# EAGLE design sensor-multichannel (EAGLE 9.6.2)
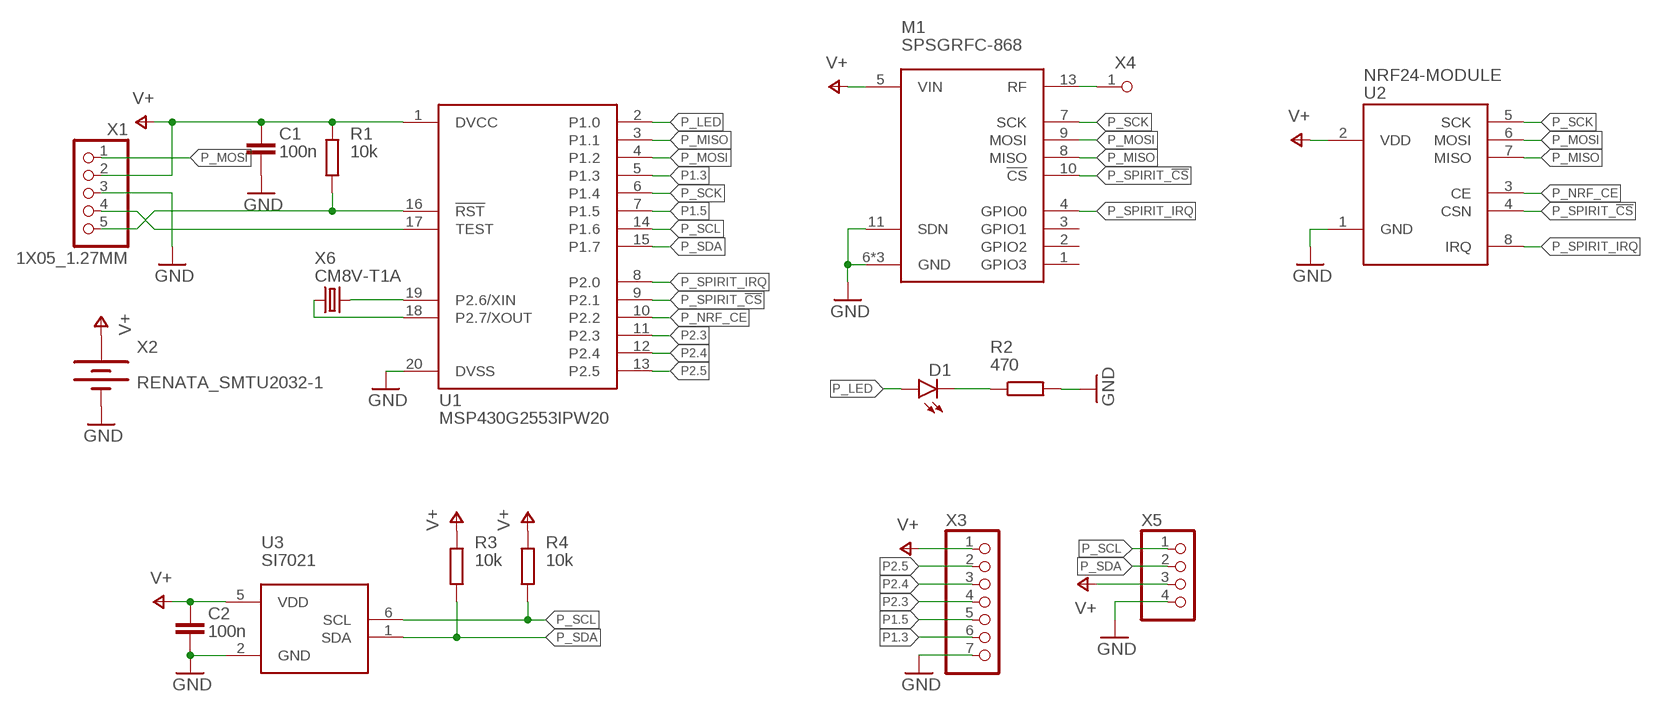
[diagram p0: schematic, sheet 1]

## Parts
C1  100n  C0603  [C0603]
C2  100n  C0603  [C0603]
D1  LEDCHIPLED_0805  [CHIPLED_0805]
M1  SPSGRFC-868  [SPSGRFC-868]
R1  10k  R0603  [R0603]
R2  470  R0603  [R0603]
R3  10k  R0603  [R0603]
R4  10k  R0603  [R0603]
U1  MSP430G2553IPW20  [PW20]
U2  NRF24-MODULE  [NRF24-MODULE]
U3  SI7021  [DFN6-3X3]
X1  1X05_1.27MM  [1X05_1.27MM]
X2  RENATA_SMTU2032-1  [RENATA_SMTU2032-1]
X3  PINHD_7_RNDNS  [1X07_NOSILK]
X4  PINHD_1_RND  [1X01_NOSILK]
X5  PINHD_4_RNDNS  [1X04_NOSILK]
X6  CM8V-T1A  [CM8V-T1A]

## Nets
GND: C1.2 C2.2 M1.6(GND) M1.11(SDN) M1.12(GND) M1.14(GND) R2.2 U1.20(DVSS) U2.1(GND) U3.2(GND) X1.3 X2.2(-) X3.7 X5.4
N$1: D1.C R2.1
N$2: R1.1 U1.16(!RST!) X1.5
N$3: U1.17(TEST) X1.4
N$4: M1.13(RF) X4.1
N$5: U1.19(P2.6/XIN) X6.P$2
N$6: U1.18(P2.7/XOUT) X6.P$1
P1.3: U1.5(P1.3) X3.6
P1.5: U1.7(P1.5) X3.5
P2.3: U1.11(P2.3) X3.4
P2.4: U1.12(P2.4) X3.3
P2.5: U1.13(P2.5) X3.2
P_LED: D1.A U1.2(P1.0)
P_MISO: M1.8(MISO) U1.3(P1.1) U2.7(MISO)
P_MOSI: M1.9(MOSI) U1.4(P1.2) U2.6(MOSI) X1.1
P_NRF_CE: U1.10(P2.2) U2.3(CE)
P_SCK: M1.7(SCK) U1.6(P1.4) U2.5(SCK)
P_SCL: R4.1 U1.14(P1.6) U3.6(SCL) X5.1
P_SDA: R3.1 U1.15(P1.7) U3.1(SDA) X5.2
P_SPIRIT_!CS: M1.10(!CS) U1.9(P2.1) U2.4(CSN)
P_SPIRIT_IRQ: M1.4(GPIO0) U1.8(P2.0) U2.8(IRQ)
V+: C1.1 C2.1 M1.5(VIN) R1.2 R3.2 R4.2 U1.1(DVCC) U2.2(VDD) U3.5(VDD) X1.2 X2.1(+) X3.1 X5.3
Unconnected: M1.1(GPIO3) M1.2(GPIO2) M1.3(GPIO1)

## Library data of the parts
C1 C2 = rfr-lib-passive:C: Standard-SMD-Kondensatoren
D1 = led:LED: LED OSRAM: - CHIPLED LG R971, LG N971, LY N971, LG Q971, LY Q971, LO R971, LY R971 LH N974, LH R974 LS Q976, LO Q976, LY Q976 LO Q996 - Hyper CHIPLED LW Q18S LB Q993, LB Q99A, LB R99A - SideLED LS A670, LO A670, LY A670, LG A670, LP A670 LB A673, LV A673, LT A673, LW A673 LH A674 LY A675 LS A676, LA A676, LO A676, LY A676, LW A676 LS A679, LY A679, LG A679 - Hyper Micro SIDELED® LS Y876, LA Y876, LO Y876, LY Y876 LT Y87S - SmartLED LW L88C, LW L88S LB L89C, LB L89S, LG L890 LS L89K, LO L89K, LY L89K LS L896, LA L896, LO L896, LY L896 - TOPLED LS T670, LO T670, LY T670, LG T670, LP T670 LSG T670, LSP T670, LSY T670, LOP T670, LYG T670 LG T671, LOG T671, LSG T671 LB T673, LV T673, LT T673, LW T673 LH T674 LS T676, LA T676, LO T676, LY T676, LB T676, LH T676, LSB T676, LW T676 LB T67C, LV T67C, LT T67C, LS T67K, LO T67K, LY T67K, LW E67C LS E67B, LA E67B, LO E67B, LY E67B, LB E67C, LV E67C, LT E67C LW T67C LS T679, LY T679, LG T679 LS T770, LO T770, LY T770, LG T770, LP T770 LB T773, LV T773, LT T773, LW T773 LH T774 LS E675, LA E675, LY E675, LS T675 LS T776, LA T776, LO T776, LY T776, LB T776 LHGB T686 LT T68C, LB T68C - Hyper Mini TOPLED® LB M676 - Mini TOPLED Santana® LG M470 LS M47K, LO M47K, LY M47K Source: http://www.osram.convergy.de LUXEON: - LUMILED® LXK2-PW12-R00, LXK2-PW12-S00, LXK2-PW14-U00, LXK2-PW14-V00 LXK2-PM12-R00, LXK2-PM12-S00, LXK2-PM14-U00 LXK2-PE12-Q00, LXK2-PE12-R00, LXK2-PE12-S00, LXK2-PE14-T00, LXK2-PE14-U00 LXK2-PB12-K00, LXK2-PB12-L00, LXK2-PB12-M00, LXK2-PB14-N00, LXK2-PB14-P00, LXK2-PB14-Q00 LXK2-PR12-L00, LXK2-PR12-M00, LXK2-PR14-Q00, LXK2-PR14-R00 LXK2-PD12-Q00, LXK2-PD12-R00, LXK2-PD12-S00 LXK2-PH12-R00, LXK2-PH12-S00 LXK2-PL12-P00, LXK2-PL12-Q00, LXK2-PL12-R00 Source: www.luxeon.com KINGBRIGHT: KA-3528ASYC Source: www.kingbright.com
M1 = rfr-lib-radio:SPSGRFC-868
R1-R4 = rfr-lib-passive:R: Standard-SMD-Widerstände
U1 = rfr-lib-digital:MSP430G2553: MSP430G2XX1 TSSOP (PW) 20 Pin Package
U2 = rfr-lib-radio:NRF24-MODULE
U3 = rfr-lib-sensors:SI7021
X1 = msp430-nrf-wsn-lib:1X05_1.27MM
X2 = msp430-nrf-wsn-lib:RENATA_SMTU2032-1
X3 = rfr-lib-connector:PINHD_7_RND: PIN HEADER
X4 = rfr-lib-connector:PINHD_1_RND
X5 = rfr-lib-connector:PINHD_4_RND
X6 = rfr-lib-passive:CM8V-T1A

## Board
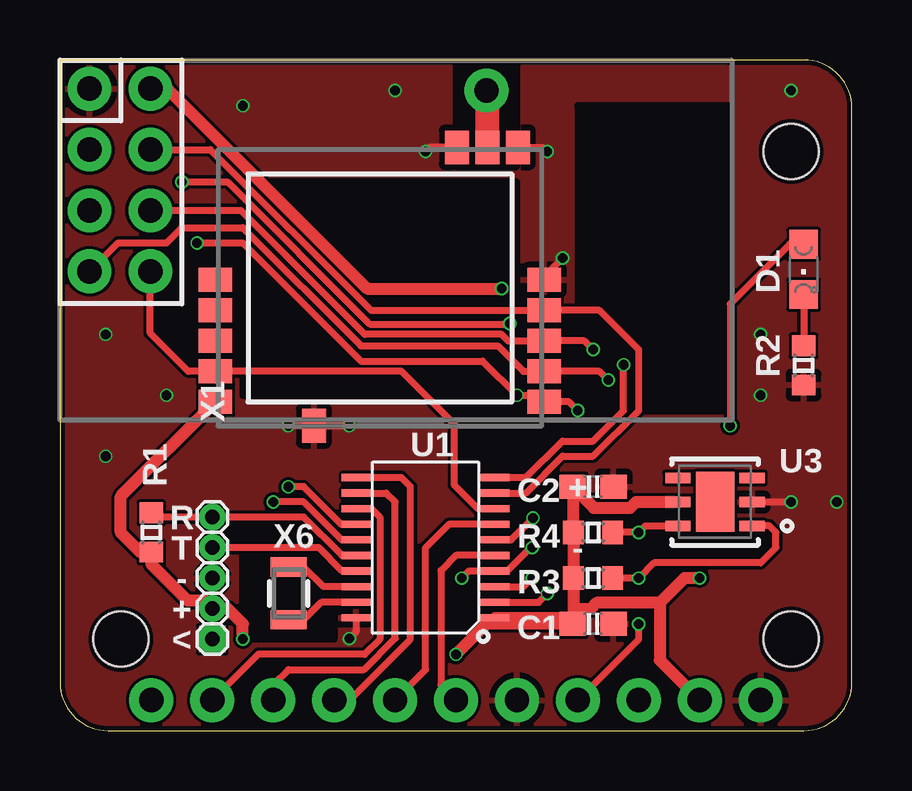
[diagram p1: board, top side]
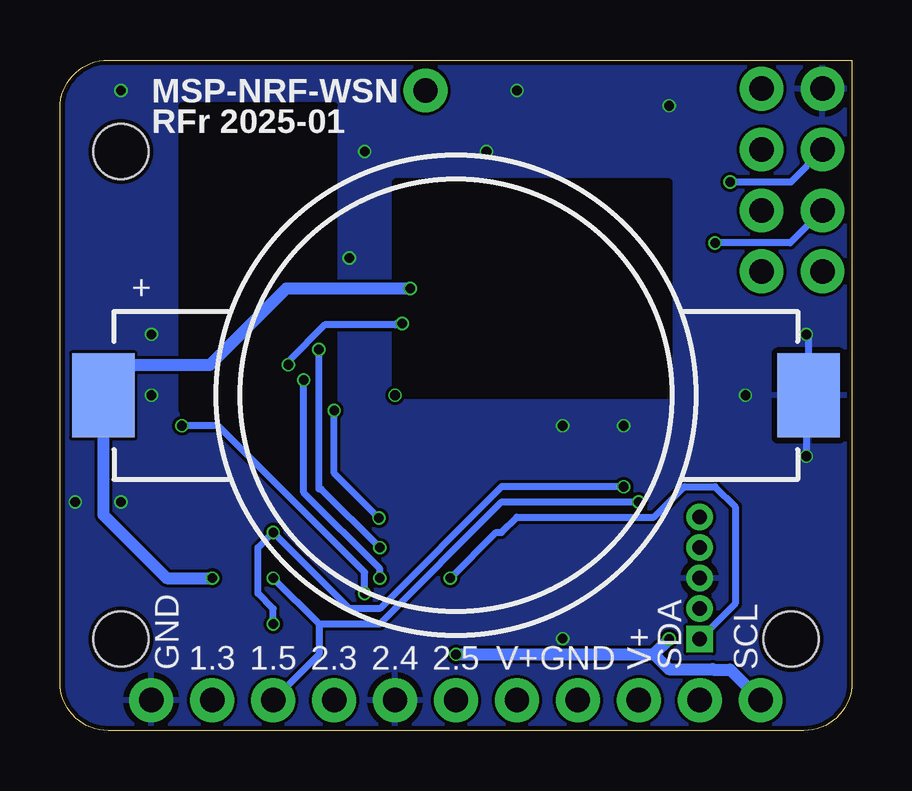
[diagram p2: board, bottom side, seen from below]

Size 33.02 x 27.94 mm. Coordinates in mm from the lower left corner, seen from the top.
Outline: 0,27.94 0,2 arc90 2,0 31.02,0 arc90 33.02,2 33.02,25.94 arc90 31.02,27.94 0,27.94
Copper layers (1*16): Top 0.035mm / dielectric 1.6mm / Bottom 0.035mm
Design rules "jlcpcb-2layers *": minimum track width 5mil, minimum drill 0.3mm, track to track 5mil, track to pad 5mil, pad to pad 5mil, via to via 5mil, smd to smd 5mil, copper to edge 0.2mm, drill to drill 6mil, minimum pad ring 10mil, minimum via ring 3mil, stop-mask expansion 4mil, vias tented up to drill 0.7mm, thermal gap 10mil
Holes 2.3 mm at 48.26,-15.24 2.54,3.81 30.48,3.81 30.48,24.13

### Footprints (pad centres in the part's own frame; a part is rotated, then mirrored left to right if it is on the bottom)
C0603 = smd 1.1 x 1: 1 -0.85,0; 2 0.85,0
CHIPLED_0805 = smd 1.2 x 1.2: A 0,-1.05; C 0,1.05
SPSGRFC-868 = smd 1.4 x 1: 1 -6.85,6.08; 2 -6.85,4.81; 3 -6.85,3.54; 4 -6.85,2.27; 5 -6.85,1; 7 6.85,1; 8 6.85,2.27; 9 6.85,3.54; 10 6.85,4.81; 11 6.85,6.08 | smd 1 x 1.4: 6 -2.75,0; 12 5.75,11.6; 13 4.48,11.6; 14 3.21,11.6
R0603 = smd 0.87 x 0.98: 1 -0.815,0; 2 0.815,0
PW20 = smd 0.3 x 1.2: 1 -2.925,-2.9; 2 -2.275,-2.9; 3 -1.625,-2.9; 4 -0.975,-2.9; 5 -0.325,-2.9; 6 0.325,-2.9; 7 0.975,-2.9; 8 1.625,-2.9; 9 2.275,-2.9; 10 2.925,-2.9; 11 2.925,2.9; 12 2.275,2.9; 13 1.625,2.9; 14 0.975,2.9; 15 0.325,2.9; 16 -0.325,2.9; 17 -0.975,2.9; 18 -1.625,2.9; 19 -2.275,2.9; 20 -2.925,2.9
NRF24-MODULE = drill 1.016 pad 1.778: 1 1.19,1.23; 2 1.19,3.77; 3 3.73,1.23; 4 3.73,3.77; 5 6.27,1.23; 6 6.27,3.77; 7 8.81,1.23; 8 8.81,3.77
DFN6-3X3 = smd 1.05 x 0.45: 1 -1.55,1; 2 -1.55,0; 3 -1.55,-1; 4 1.55,-1; 5 1.55,0; 6 1.55,1 | smd 1.6 x 2.5: EXP 0,0
1X05_1.27MM = drill 0.6 square: 1 -2.54,0 | drill 0.6: 2 -1.27,0; 3 0,0; 4 1.27,0; 5 2.54,0
RENATA_SMTU2032-1 = smd 2.6 x 3.5: 1 -14.7,0; 2 14.7,0
1X07_NOSILK = drill 1.016 pad 1.778: 1 -7.62,0; 2 -5.08,0; 3 -2.54,0; 4 0,0; 5 2.54,0; 6 5.08,0; 7 7.62,0
1X01_NOSILK = drill 1.016 pad 1.778: 1 0,0
1X04_NOSILK = drill 1.016 pad 1.778: 1 -3.81,0; 2 -1.27,0; 3 1.27,0; 4 3.81,0
CM8V-T1A = smd 0.8 x 1.5: P$1 -1.1,0; P$2 1.1,0

### Placement (x,y rotation side)
C1  22.23,4.45 0 top
C2  22.23,10.16 0 top
D1  31,19.21 180 top
M1  13.34,12.7 0 top
R1  3.81,8.25 270 top
R2  31,15.21 270 top
R3  22.23,6.35 180 top
R4  22.23,8.25 180 top
U1  15.24,7.62 90 top
U2  0,27.94 270 top
U3  27.3,9.53 180 top
X1  6.35,6.35 90 top
X2  16.51,13.97 0 bottom
X3  11.43,1.27 0 top
X4  17.78,26.67 0 top
X5  25.4,1.27 0 top
X6  9.53,5.71 270 top

### Tracks (layer width: path | path; a pad name or v marks a point on that pad's centre or on a via)
GND  (via drill 0.4)
  Top 0.3: M1.14 15.41,24.3 v15.24,24.13 | M1.12 20.15,24.3 v20.32,24.13 | v20.95,19.68 20.18,18.91 M1.11 | v12.06,12.7 M1.6 v9.53,12.7 | U3.2 v30.48,9.53 | U1.20 12.34,4.1 v12.06,3.83
  Bottom 0.3: v1.91,16.51 1.81,16.41 X2.2 1.91,13.88 v1.91,11.43
  other vias: 32.38,9.53 29.21,13.97 29.21,16.51 7.62,26.04 4.45,13.97 13.97,26.67 30.48,26.67
  pour Top: -0.64,28.57 34.29,28.57 34.29,-1.27 -0.64,-1.27
  pour Bottom: 33.66,29.21 -1.27,29.21 -1.27,-0.63 33.66,-0.63
  cutout Top: 11.43,3.81 7.62,3.81 7.62,7.62 11.43,7.62
  cutout Bottom: 7.62,13.97 7.62,22.86 19.05,22.86 19.05,13.97
  cutout Top: 19.05,13.97 19.05,22.86 7.62,22.86 7.62,13.97
  cutout Top: 19.05,23.49 19.05,27.94 16.51,27.94 16.51,23.49
  cutout Top: 21.59,26.04 21.59,13.34 27.94,13.34 27.94,26.04
  cutout Bottom: 27.94,26.04 27.94,13.34 21.59,13.34 21.59,26.04
N$1
  Top 0.3: D1.C R2.1
N$2
  Top 0.3: U1.16 11.76,7.29 10.16,8.89 X1.5 3.99,8.89 R1.1
N$3
  Top 0.3: U1.17 11.77,6.65 10.79,7.62 7.62,7.62 X1.4
N$4
  Top 1: M1.13 17.82,26.63 X4.1
N$5
  Top 0.3: U1.19 10.89,5.35 10.16,4.62 X6.P$2
N$6
  Top 0.3: U1.18 10.98,6 10.16,6.82 X6.P$1
P1.3
  Top 0.3: U1.5 16.5,7.29 15.88,6.67 15.88,1.91 X3.6
P1.5
  Top 0.3: U1.7 16.21,8.59 15.24,7.62 15.24,2.54 X3.5
P2.3
  Top 0.3: U1.11 14.22,10.55 14.61,10.16 14.61,3.81 12.06,1.27 X3.4
P2.4
  Top 0.3: U1.12 13.6,9.89 13.97,9.53 13.97,3.84 12.67,2.54 9.53,2.54 8.89,1.91 X3.3
P2.5
  Top 0.3: U1.13 12.98,9.25 13.34,8.89 13.34,3.81 12.7,3.17 8.26,3.17 X3.2
P_LED  (via drill 0.4)
  Top 0.3: D1.A 30.43,20.27 27.94,17.78 v27.94,12.7 | U1.2 19.95,5.35 v20.32,5.71
  Bottom 0.3: v27.94,12.7 26.43,12.7 20.32,6.59 v20.32,5.71
P_MISO  (via drill 0.4)
  Top 0.3: v22.86,14.61 22.5,14.97 M1.8 19.32,14.97 18.26,16.03 12.54,16.03 7.62,20.95 5.08,20.95 4.45,20.32 2.42,20.32 U2.7 | U1.3 19.33,6 v19.68,6.35
  Bottom 0.3: v22.86,14.61 22.86,9.91 19.68,6.74 v19.68,6.35
P_MOSI  (via drill 0.4)
  Top 0.3: v22.23,15.88 21.86,16.24 M1.9 18.68,16.24 18.41,16.51 12.7,16.51 7.54,21.67 U2.6 | v19.68,7.62 19.61,7.62 18.63,6.65 U1.4 17.04,6.65 v16.75,6.35
  Bottom 0.3: v22.23,15.88 22.23,10.06 22.12,10.06 v19.68,7.62 | v16.75,6.35 14.84,8.25 14.61,8.25 13.97,8.89 8.26,8.89 6.99,10.16 5.71,10.16 4.87,9.32 4.87,5.29 X1.1
P_NRF_CE  (via drill 0.4)
  Top 0.3: U1.10 19.43,10.55 20.95,12.07 22.23,12.07 23.5,13.34 v23.5,15.24 | v5.08,22.86 6.99,22.86 12.91,16.94 18.73,16.94 v18.75,16.96
  Bottom 0.3: v23.5,15.24 23.5,15.39 21.98,16.9 19.05,16.9 18.99,16.96 v18.75,16.96 | U2.3 1.23,24.17 2.54,22.86 3.27,22.86 3.28,22.86 v5.08,22.86
P_SCK  (via drill 0.4)
  Top 0.3: U1.6 18.81,7.95 v19.72,8.86 | v21.59,13.34 21.23,13.7 20.32,13.7 | 20.32,13.7 M1.7 | 20.32,13.7 20.05,13.97 v19.05,13.97 17.62,15.4 12.54,15.4 7.62,20.32 v5.71,20.32
  Bottom 0.3: v19.72,8.86 21.59,10.73 v21.59,13.34 | U2.5 2.58,20.32 v5.71,20.32
P_SCL  (via drill 0.4)
  Top 0.3: U1.14 11.72,8.59 10.16,10.16 v9.53,10.16 | U3.6 24.4,8.53 v24.13,8.25 R4.1 | X5.1 24.13,3.81 v24.13,4.45
  Bottom 0.3: v9.53,10.16 14.61,10.16 19.68,5.08 20.95,5.08 v24.13,8.25 24.77,7.62 24.77,5.71 24.13,5.08 v24.13,4.45
P_SDA  (via drill 0.4)
  Top 0.3: U1.15 11.74,7.95 10.16,9.53 v8.89,9.53 | R3.1 v24.13,6.35 24.77,6.99 29.21,6.99 29.84,7.62 29.84,8.25 29.57,8.53 U3.1
  Bottom 0.3: v8.89,9.53 14.61,9.53 19.68,4.45 22.23,4.45 | v24.13,6.35 22.23,4.45 | 22.23,4.45 22.23,3.17 X5.2
P_SPIRIT_!CS
  Top 0.3: U1.9 19.42,9.89 20.95,11.43 22.23,11.43 24.13,13.34 24.13,15.88 22.5,17.51 M1.10 12.97,17.51 6.27,24.21 U2.4
P_SPIRIT_IRQ
  Top 0.3: U1.8 17.43,9.25 16.44,10.23 16.44,12.77 14.24,14.97 M1.4 5.35,14.97 3.77,16.55 U2.8
V+  (via drill 0.4)
  Top 0.5: 21.41,5.08 R3.2 R4.2 21.38,8.29 C2.1 22.25,9.28 23.78,9.28 24.02,9.53 U3.5 | 21.41,5.08 21.41,4.48 C1.1 | U1.1 21.12,4.7 C1.1 | M1.5 2.54,9.75 2.54,8.25 3.35,7.44 R1.2 3.81,6.94 5.33,5.42 6.01,5.42 X1.2 6.99,5.08 7.62,4.45 v7.62,3.81 | 21.41,5.08 22.13,5.08 22.37,5.32 25.01,5.32 | U2.2 4.47,26.75 12.81,18.41 v18.41,18.41 | v26.67,6.35 26.04,6.35 25.01,5.32 | C1.1 17.78,4.45 v16.51,3.17 | 25.01,5.32 25.01,2.93 X5.3
  Bottom 0.5: v18.41,18.41 23.59,18.41 26.77,15.24 29.94,15.24 X2.1 31.21,8.98 28.57,6.35 v26.67,6.35 | v16.51,3.17 8.26,3.17 | v7.62,3.81 8.26,3.17 | 8.26,3.17 7.64,2.56 5.82,2.56 5.79,2.54 5.08,2.54 X3.1

### Text on the board
tPlace: + | R | T | - | - | + | <
bPlace: MSP-NRF-WSN | RFr 2025-01 | SCL | SDA | V+ | GND | V+ | 2.5 | 2.4 | 2.3 | 1.5 | 1.3 | GND